# EasyEDA Pro project 赛博樱花灯.epro, schematic Schematic1
Board Name: 上面板V0.1; Create Date: 2025-05-01; Page Name: P1; Project Name: 噬菌体拾音灯; Schematic Name: Schematic1; Update Date: 2025-05-01; Company: 嘉立创EDA; Page Size: A3; Version: V1.0
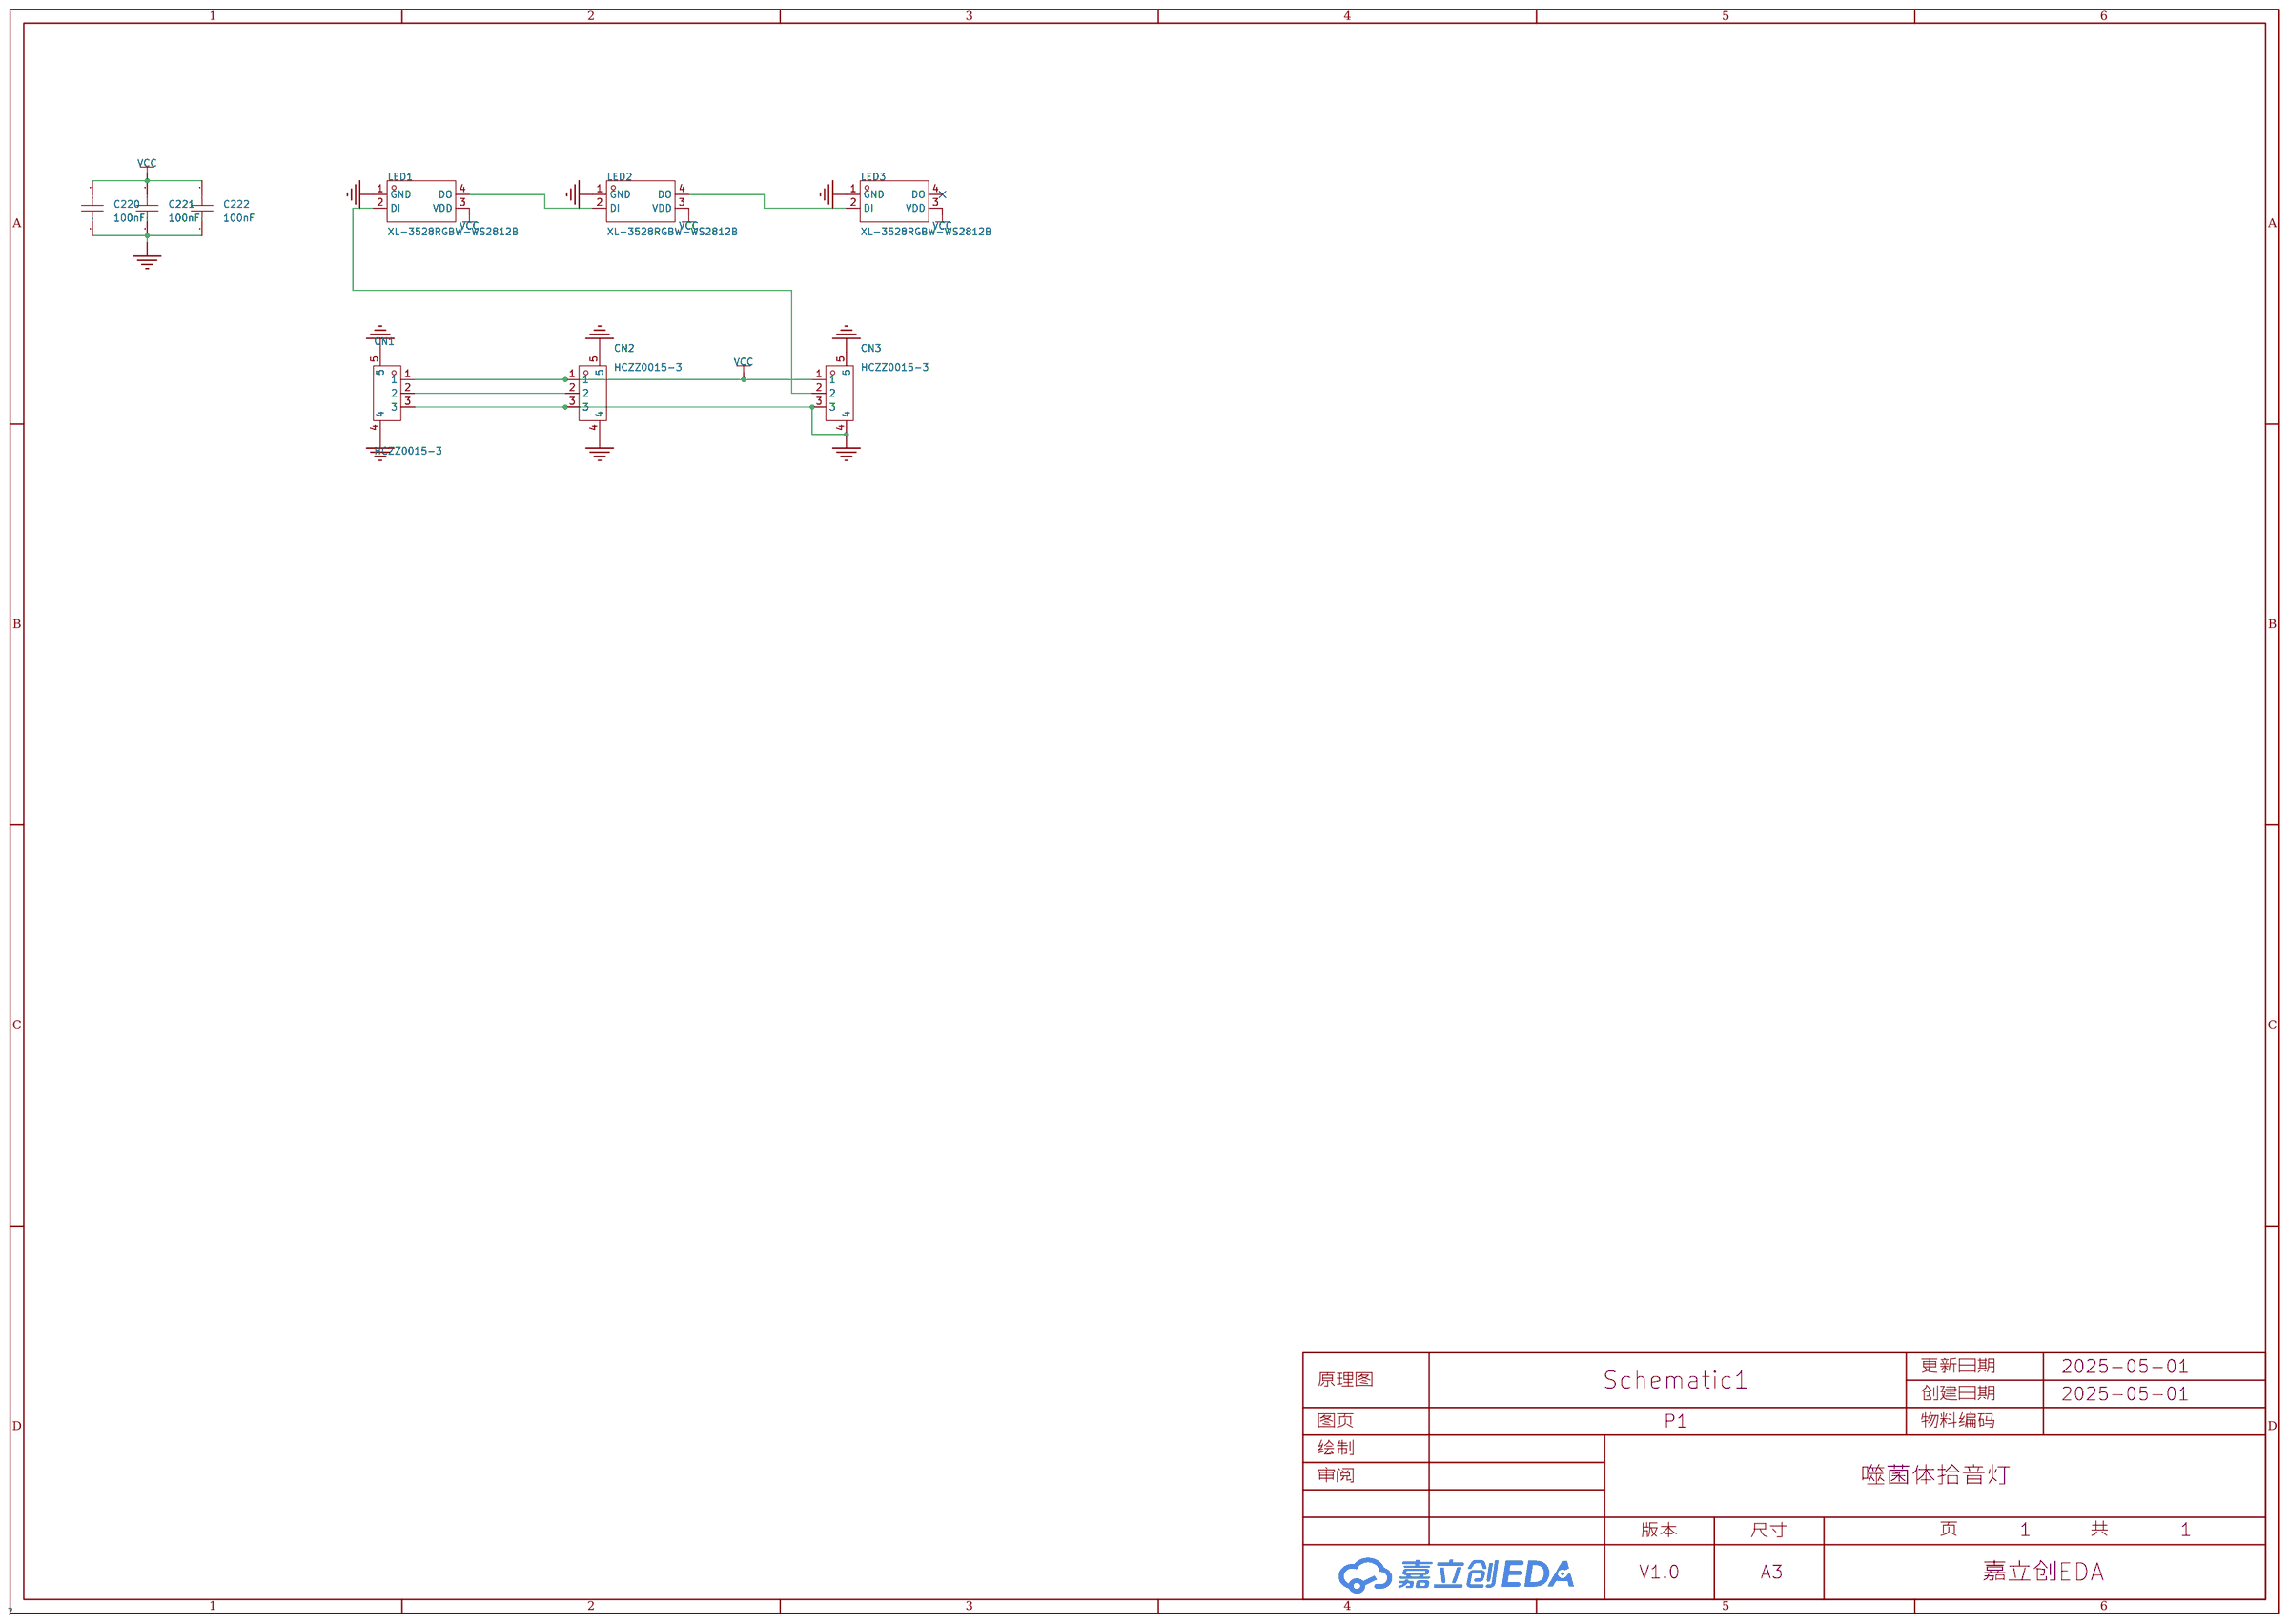
[diagram p0: schematic sheet]

## Parts
C220  100nF  [C0603]
C221  100nF  [C0603]
C222  100nF  [C0603]
CN1  HCZZ0015-3  [CONN-SMD_3P-P1.25-L3.3-W8.8]
CN2  HCZZ0015-3  [CONN-SMD_3P-P1.25-L3.3-W8.8]
CN3  HCZZ0015-3  [CONN-SMD_3P-P1.25-L3.3-W8.8]
LED1  XL-3528RGBW-WS2812B  [LED-SMD_4P-L3.5-W2.8-BR-1]
LED2  XL-3528RGBW-WS2812B  [LED-SMD_4P-L3.5-W2.8-BR-1]
LED3  XL-3528RGBW-WS2812B  [LED-SMD_4P-L3.5-W2.8-BR-1]

## Library data of the parts
C220-C222 = CGA0603X7R104K500JT: 容值:100nF;精度:±10%;额定电压:50V;温度系数:X7R;; LCSC Part Name: 100nF ±10% 50V; Supplier Part: C6119867; Manufacturer: HRE(芯声); Supplier Footprint: 0603; JLCPCB Part Class: 扩展库; Datasheet: https://atta.szlcsc.com/upload/public/pdf/source/20250103/C44077DA9E7B3EFAE02F22B6D3D1CBC9.pdf; Supplier: LCSC; Tolerance: ±10%; Voltage Rating: 50V; Temperature Coefficient: X7R
CN1-CN3 = HCZZ0015-3: 插针结构:1x3P;间距:1.25mm;安装方式:立贴;参考系列:PicoBlade(MX 1.25);总PIN数:3P;排数:1;每排PIN数:3;行距:-;额定电流:1A;触头材质:铜;触头镀层:锡;工作温度:-25℃~+70℃;; LCSC Part Name: 米色 1x3P 间距:1.25mm 立贴闭口不加盖 系列:PicoBlade(MX 1.25); Supplier Part: C7433469; Manufacturer: HC(虹成电子); Supplier Footprint: SMD,P=1.25mm; JLCPCB Part Class: 扩展库; Datasheet: https://atta.szlcsc.com/upload/public/pdf/source/20250106/1F447D40D9750342B547DDF7C651415A.pdf; Supplier: LCSC; Pins Structure: 1x3P; Pitch: 1.25mm; Mounting Type: 立贴; Reference Series: PicoBlade(MX 1.25); Number of Pins: 3P; Number of Rows: 1; Number of PINs Per Row: 3; Current Rating: 1A; Contact Material: 铜; Contact Plating: 锡; Operating Temperature: -25℃~+70℃; Voltage Rating: 125V; Plastic Material: LCP; Color: 米色; Z-Height of the Board: 4.6mm; X-Length of Bottom Edge on Board (Spacing Line): 8.85mm; Y-Width of Bottom Edge on Board: 4.3mm
LED1-LED3 = XL-3528RGBW-WS2812B: 3528 七彩幻彩雾状 ws2812B 内置驱动IC; Supplier Part: C2890364; Manufacturer: XINGLIGHT(成兴光); Supplier Footprint: SMD3528-4P; JLCPCB Part Class: 扩展库; Datasheet: https://atta.szlcsc.com/upload/public/pdf/source/20240218/041E1E0D0024617DFFF124D9C311BB4D.pdf; Supplier: LCSC

## Nets
GND: C220.1 C221.1 C222.1 CN1.3 CN1.4 CN1.5 CN2.3 CN2.4 CN2.5 CN3.3 CN3.4 CN3.5 LED1.1(GND) LED2.1(GND) LED3.1(GND)
VCC: C220.2 C221.2 C222.2 CN1.1 CN2.1 CN3.1 LED1.3(VDD) LED2.3(VDD) LED3.3(VDD)
$1N828: LED1.4(DO) LED2.2(DI)
$1N837: LED2.4(DO) LED3.2(DI)
$1N1037: CN1.2 CN2.2
$1N1096: CN3.2 LED1.2(DI)

Not connected (* = marked no-connect by the designer): LED3 4(DO)*
